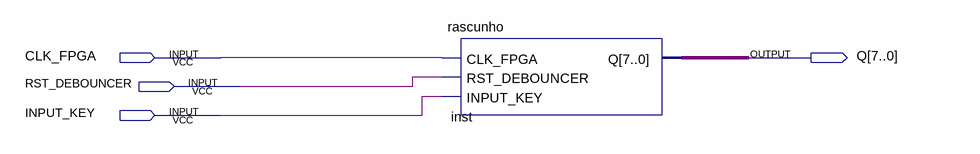
[diagram p0: schematic sheet]
// Quartus schematic Projeto-CPU-fly.bdf as structural Verilog: 1 symbols, 4 pins
module \Projeto-CPU-fly  (
  input  CLK_FPGA,
  input  RST_DEBOUNCER,
  input  INPUT_KEY,
  output [7:0] Q
);

  rascunho inst (.CLK_FPGA(CLK_FPGA), .RST_DEBOUNCER(RST_DEBOUNCER), .INPUT_KEY(INPUT_KEY), .Q(Q));
endmodule
